# EAGLE design protoboard (EAGLE 6.4)
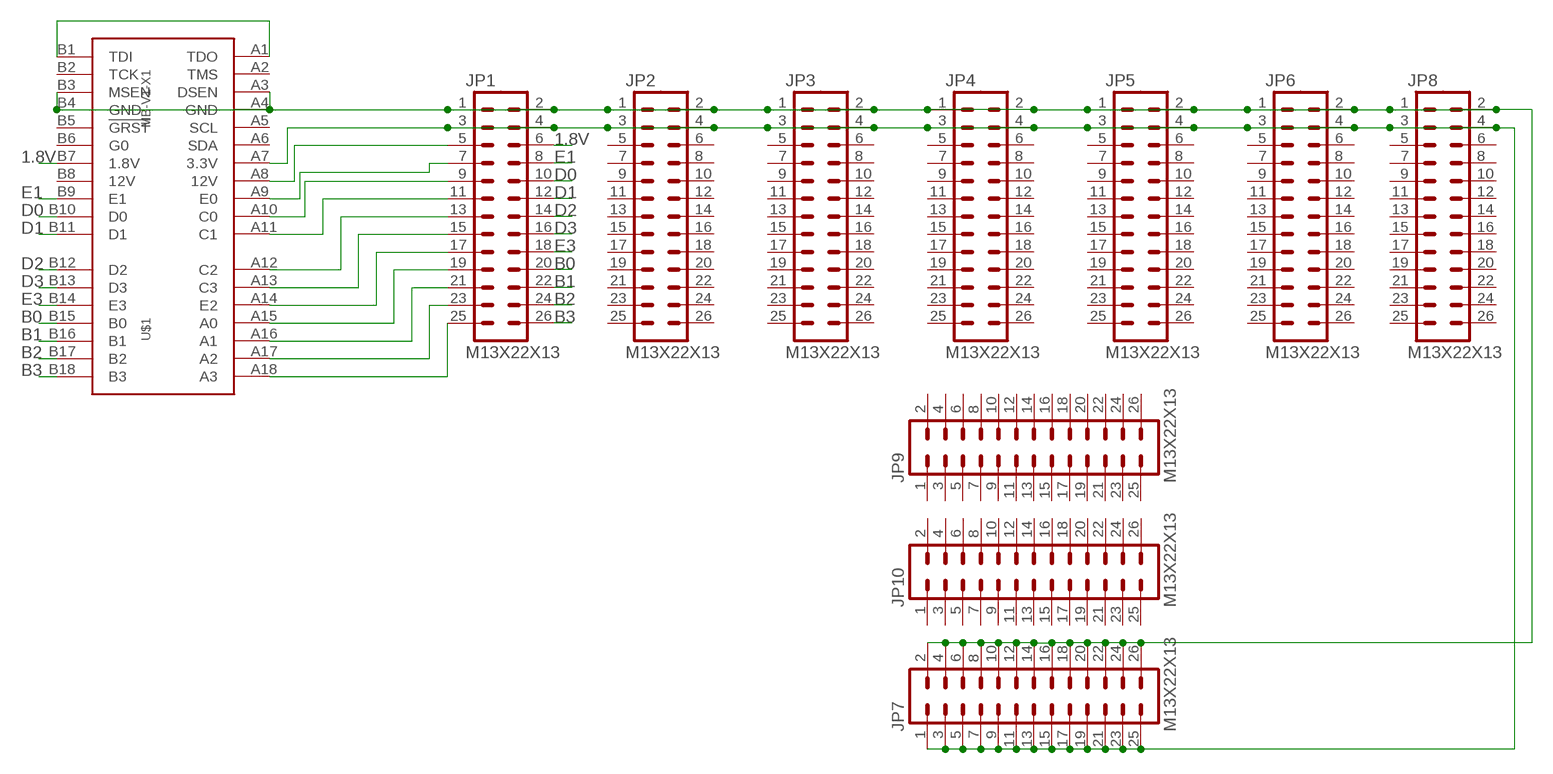
[diagram p0: schematic, sheet 1]

## Parts
JP1  M13X22X13  [2X13]
JP2  M13X22X13  [2X13]
JP3  M13X22X13  [2X13]
JP4  M13X22X13  [2X13]
JP5  M13X22X13  [2X13]
JP6  M13X22X13  [2X13]
JP7  M13X22X13  [2X13]
JP8  M13X22X13  [2X13]
JP9  M13X22X13  [2X13]
JP10  M13X22X13  [2X13]
U$1  MB-V1-X1  [PCIE-X1-EDGE]

## Nets
1.8V: JP1.6 U$1.B7(1.8V)
3.3V: JP1.3 JP1.4 JP2.3 JP2.4 JP3.3 JP3.4 JP4.3 JP4.4 JP5.3 JP5.4 JP6.3 JP6.4 JP7.1 JP7.3 JP7.5 JP7.7 JP7.9 JP7.11 JP7.13 JP7.15 JP7.17 JP7.19 JP7.21 JP7.23 JP7.25 JP8.3 JP8.4 U$1.A7(3.3V)
B0: JP1.20 U$1.B15(B0)
B1: JP1.22 U$1.B16(B1)
B2: JP1.24 U$1.B17(B2)
B3: JP1.26 U$1.B18(B3)
D0: JP1.10 U$1.B10(D0)
D1: JP1.12 U$1.B11(D1)
D2: JP1.14 U$1.B12(D2)
D3: JP1.16 U$1.B13(D3)
E1: JP1.8 U$1.B9(E1)
E3: JP1.18 U$1.B14(E3)
GND: JP1.1 JP1.2 JP2.1 JP2.2 JP3.1 JP3.2 JP4.1 JP4.2 JP5.1 JP5.2 JP6.1 JP6.2 JP7.2 JP7.4 JP7.6 JP7.8 JP7.10 JP7.12 JP7.14 JP7.16 JP7.18 JP7.20 JP7.22 JP7.24 JP7.26 JP8.1 JP8.2 U$1.A3(DSEN) U$1.A4(GND) U$1.B3(MSEN) U$1.B4(GND)
N$1: U$1.A1(TDO) U$1.B1(TDI)
N$2: JP1.5 U$1.A8(12V)
N$4: JP1.25 U$1.A18(A3)
N$5: JP1.23 U$1.A17(A2)
N$6: JP1.21 U$1.A16(A1)
N$7: JP1.19 U$1.A15(A0)
N$8: JP1.17 U$1.A14(E2)
N$9: JP1.15 U$1.A13(C3)
N$10: JP1.13 U$1.A12(C2)
N$11: JP1.11 U$1.A11(C1)
N$12: JP1.9 U$1.A10(C0)
N$13: JP1.7 U$1.A9(E0)
Unconnected: JP2.5 JP2.6 JP2.7 JP2.8 JP2.9 JP2.10 JP2.11 JP2.12 JP2.13 JP2.14 JP2.15 JP2.16 JP2.17 JP2.18 JP2.19 JP2.20 JP2.21 JP2.22 JP2.23 JP2.24 JP2.25 JP2.26 JP3.5 JP3.6 JP3.7 JP3.8 JP3.9 JP3.10 JP3.11 JP3.12 JP3.13 JP3.14 JP3.15 JP3.16 JP3.17 JP3.18 JP3.19 JP3.20 JP3.21 JP3.22 JP3.23 JP3.24 JP3.25 JP3.26 JP4.5 JP4.6 JP4.7 JP4.8 JP4.9 JP4.10 JP4.11 JP4.12 JP4.13 JP4.14 JP4.15 JP4.16 JP4.17 JP4.18 JP4.19 JP4.20 JP4.21 JP4.22 JP4.23 JP4.24 JP4.25 JP4.26 JP5.5 JP5.6 JP5.7 JP5.8 JP5.9 JP5.10 JP5.11 JP5.12 JP5.13 JP5.14 JP5.15 JP5.16 JP5.17 JP5.18 JP5.19 JP5.20 JP5.21 JP5.22 JP5.23 JP5.24 JP5.25 JP5.26 JP6.5 JP6.6 JP6.7 JP6.8 JP6.9 JP6.10 JP6.11 JP6.12 JP6.13 JP6.14 JP6.15 JP6.16 JP6.17 JP6.18 JP6.19 JP6.20 JP6.21 JP6.22 JP6.23 JP6.24 JP6.25 JP6.26 JP8.5 JP8.6 JP8.7 JP8.8 JP8.9 JP8.10 JP8.11 JP8.12 JP8.13 JP8.14 JP8.15 JP8.16 JP8.17 JP8.18 JP8.19 JP8.20 JP8.21 JP8.22 JP8.23 JP8.24 JP8.25 JP8.26 JP9.1 JP9.2 JP9.3 JP9.4 JP9.5 JP9.6 JP9.7 JP9.8 JP9.9 JP9.10 JP9.11 JP9.12 JP9.13 JP9.14 JP9.15 JP9.16 JP9.17 JP9.18 JP9.19 JP9.20 JP9.21 JP9.22 JP9.23 JP9.24 JP9.25 JP9.26 JP10.1 JP10.2 JP10.3 JP10.4 JP10.5 JP10.6 JP10.7 JP10.8 JP10.9 JP10.10 JP10.11 JP10.12 JP10.13 JP10.14 JP10.15 JP10.16 JP10.17 JP10.18 JP10.19 JP10.20 JP10.21 JP10.22 JP10.23 JP10.24 JP10.25 JP10.26 U$1.A2(TMS) U$1.A5(SCL) U$1.A6(SDA) U$1.B2(TCK) U$1.B5(!GRST) U$1.B6(G0) U$1.B8(12V)

## Library data of the parts
JP1-JP10 = scratch:M13X2: 0.1" spaced headers
U$1 = kmod-connectors:MB-V1-X1

## Board
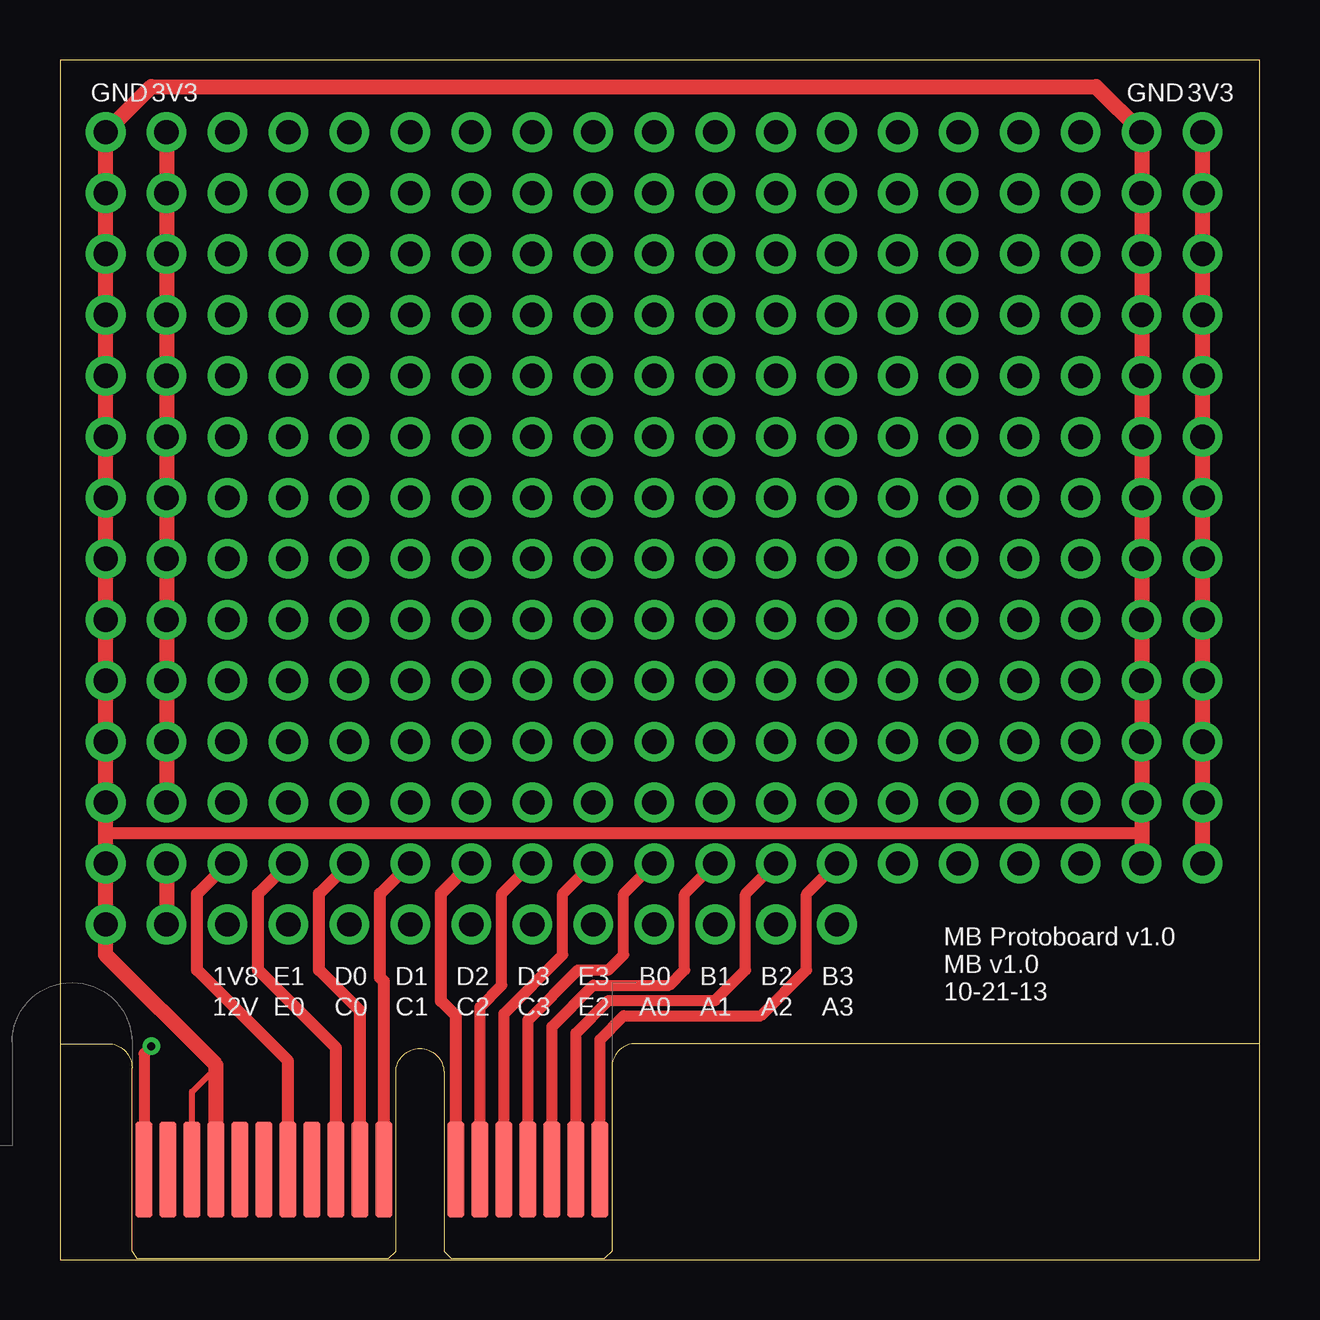
[diagram p1: board, top side]
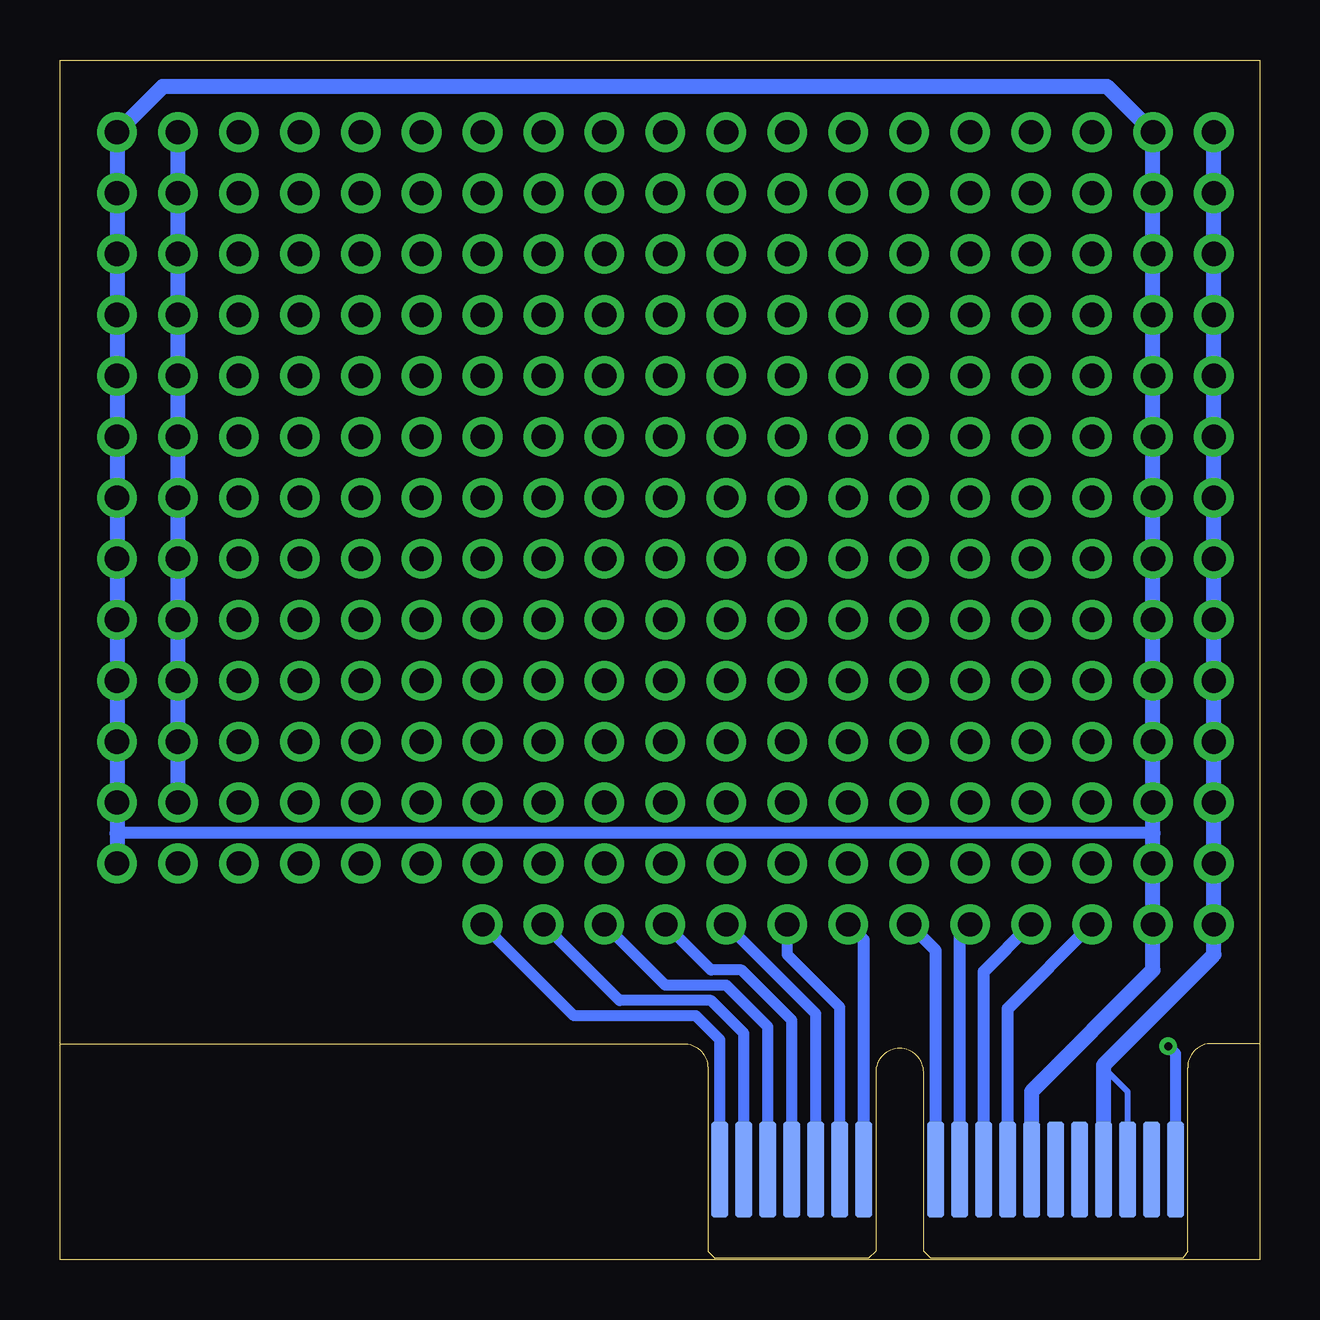
[diagram p2: board, bottom side, seen from below]

Size 50 x 50 mm. Coordinates in mm from the lower left corner, seen from the top.
Outline: 0,9 0,0 50,0 50,50 0,50 0,9
Outline: 0,9 2,9 arc-90 3,8
Outline: 50,9 24,9 arc90 23,8
Copper layers (1*16): Top 0.035mm / dielectric 1.5mm / Bottom 0.035mm
Design rules "SeeedStudio_mine": minimum track width 6mil, minimum drill 12mil, track to track 6mil, track to pad 6mil, pad to pad 6mil, via to via 6mil, smd to smd 6mil, copper to edge 10mil, drill to drill 10mil, minimum pad ring 6mil, minimum via ring 8mil, stop-mask expansion 2mil, vias tented up to drill 25mil, thermal gap 10mil

### Footprints (pad centres in the part's own frame; a part is rotated, then mirrored left to right if it is on the bottom)
2X13 = drill 1.016 pad 1.651: 1 0,0; 2 0,2.54; 3 2.54,0; 4 2.54,2.54; 5 5.08,0; 6 5.08,2.54; 7 7.62,0; 8 7.62,2.54; 9 10.16,0; 10 10.16,2.54; 11 12.7,0; 12 12.7,2.54; 13 15.24,0; 14 15.24,2.54; 15 17.78,0; 16 17.78,2.54; 17 20.32,0; 18 20.32,2.54; 19 22.86,0; 20 22.86,2.54; 21 25.4,0; 22 25.4,2.54; 23 27.94,0; 24 27.94,2.54; 25 30.48,0; 26 30.48,2.54
PCIE-X1-EDGE = smd 0.7 x 4 bottom: A1 -11.5,-0.75; A2 -10.5,-0.75; A3 -9.5,-0.75; A4 -8.5,-0.75; A5 -7.5,-0.75; A6 -6.5,-0.75; A7 -5.5,-0.75; A8 -4.5,-0.75; A9 -3.5,-0.75; A10 -2.5,-0.75; A11 -1.5,-0.75; A12 1.5,-0.75; A13 2.5,-0.75; A14 3.5,-0.75; A15 4.5,-0.75; A16 5.5,-0.75; A17 6.5,-0.75; A18 7.5,-0.75 | smd 0.7 x 4: B1 -11.5,-0.75; B2 -10.5,-0.75; B3 -9.5,-0.75; B4 -8.5,-0.75; B5 -7.5,-0.75; B6 -6.5,-0.75; B7 -5.5,-0.75; B8 -4.5,-0.75; B9 -3.5,-0.75; B10 -2.5,-0.75; B11 -1.5,-0.75; B12 1.5,-0.75; B13 2.5,-0.75; B14 3.5,-0.75; B15 4.5,-0.75; B16 5.5,-0.75; B17 6.5,-0.75; B18 7.5,-0.75

### Placement (x,y rotation side)
JP1  1.91,13.97 0 top
JP2  1.91,19.05 0 top
JP3  1.91,24.13 0 top
JP4  1.91,29.21 0 top
JP5  1.91,34.29 0 top
JP6  1.91,39.37 0 top
JP7  47.62,16.51 90 top
JP8  1.91,44.45 0 top
JP9  37.47,16.51 90 top
JP10  42.55,16.51 90 top
U$1  15,4.5 0 top

### Tracks (layer width: path | path; a pad name or v marks a point on that pad's centre or on a via)
1.8V
  Top 0.508: U$1.B7 9.5,8.28 5.71,12.06 5.71,15.24 JP1.6
3.3V
  Top 0.635: JP7.1 JP7.25 | JP8.4 JP2.3 | JP1.4 JP1.3
  Bottom 0.508: 4.45,17.78 47.62,17.78
  Bottom 0.635: U$1.A7 9.5,7.01 4.45,12.06 JP1.3 JP1.4 4.45,17.78 JP2.3 JP2.4 JP3.3 JP3.4 JP4.3 JP4.4 JP5.3 JP5.4 JP6.3 JP6.4 JP8.3 JP8.4 6.35,48.9 45.72,48.9 JP7.25 JP7.23 JP7.21 JP7.19 JP7.17 JP7.15 JP7.13 JP7.11 JP7.9 JP7.7 JP7.5 JP7.3 47.62,17.78 JP7.1
B0
  Top 0.457: U$1.B15 19.5,9.97 21.59,12.06 22.86,12.06 23.5,12.7 23.5,15.24 JP1.20
B1
  Top 0.457: U$1.B16 20.5,9.71 22.23,11.43 25.4,11.43 26.04,12.06 26.04,15.24 JP1.22
B2
  Top 0.457: U$1.B17 21.5,9.44 22.86,10.79 27.3,10.79 28.57,12.06 28.57,15.24 JP1.24
B3
  Top 0.457: U$1.B18 22.5,9.16 23.5,10.16 29.21,10.16 31.11,12.06 31.11,15.24 JP1.26
D0
  Top 0.508: U$1.B10 12.5,10.36 10.79,12.06 10.79,15.24 JP1.10
D1
  Top 0.508: U$1.B11 13.5,11.6 13.34,11.76 13.34,15.24 JP1.12
D2
  Top 0.508: U$1.B12 16.5,10.15 15.88,10.78 15.88,15.24 JP1.14
D3
  Top 0.457: U$1.B13 17.5,10.52 18.41,11.43 18.41,15.24 JP1.16
E1
  Top 0.508: U$1.B9 11.5,8.82 8.26,12.06 8.26,15.24 JP1.8
E3
  Top 0.457: U$1.B14 18.5,10.24 20.95,12.7 20.95,15.24 JP1.18
GND
  Top 0.254: U$1.A3 5.5,7 6.5,8
  Top 0.508: 1.91,17.78 45.09,17.78
  Top 0.635: U$1.A4 6.5,8 6.5,8.11 1.91,12.7 JP1.1 JP1.2 1.91,17.78 JP2.1 JP2.2 JP3.1 JP3.2 JP4.1 JP4.2 JP5.1 JP5.2 JP6.1 JP6.2 JP8.1 JP8.2 3.81,48.9 43.18,48.9 JP7.26 JP7.24 JP7.22 JP7.20 JP7.18 JP7.16 JP7.14 JP7.12 JP7.10 JP7.8 JP7.6 JP7.4 45.09,17.78 JP7.2
  Bottom 0.254: U$1.A3 5.5,7 6.5,8
  Bottom 0.635: U$1.A4 6.5,8 6.5,8.11 1.91,12.7 JP1.1 JP8.2 | JP7.26 JP7.4
N$1  (via drill 0.33)
  Top 0.457: v3.81,8.89 3.5,8.58 U$1.B1
  Bottom 0.457: U$1.B1 3.5,8.58 v3.81,8.89
N$2
  Bottom 0.508: U$1.A8 10.5,10.46 JP1.5
N$4
  Bottom 0.457: U$1.A18 22.5,9.16 23.5,10.16 28.57,10.16 JP1.25
N$5
  Bottom 0.457: U$1.A17 21.5,9.44 22.86,10.79 26.67,10.79 JP1.23
N$6
  Bottom 0.457: U$1.A16 20.5,9.71 22.23,11.43 24.77,11.43 JP1.21
N$7
  Bottom 0.457: U$1.A15 19.5,9.97 21.59,12.06 22.86,12.06 JP1.19
N$8
  Bottom 0.457: U$1.A14 18.5,10.24 JP1.17
N$9
  Bottom 0.457: U$1.A13 17.5,10.52 19.68,12.7 JP1.15
N$10
  Bottom 0.508: U$1.A12 16.5,13.32 JP1.13
N$11
  Bottom 0.508: U$1.A11 13.5,12.87 JP1.11
N$12
  Bottom 0.508: U$1.A10 12.5,13.54 JP1.9
N$13
  Bottom 0.508: U$1.A9 11.5,11.99 JP1.7

### Text on the board
tPlace: GND | 3V3 | GND | 3V3 | 1V8 | E1 | D0 | D1 | D2 | D3 | E3 | B0 | B1 | B2 | B3 | MB Protoboard v1.0 / MB v1.0 / 10-21-13 | 12V | E0 | C0 | C1 | C2 | C3 | E2 | A0 | A1 | A2 | A3